# EasyEDA Pro project CR2.epro

# Schematic Schematic2
Board Name: Board2; Create Date: 2024-12-13; Page Name: P1; Project Name: kpi2024_0; Schematic Name: Schematic2; Update Date: 2024-12-13; Company: EasyEDA.com; Page Size: A4; Version: V1.0
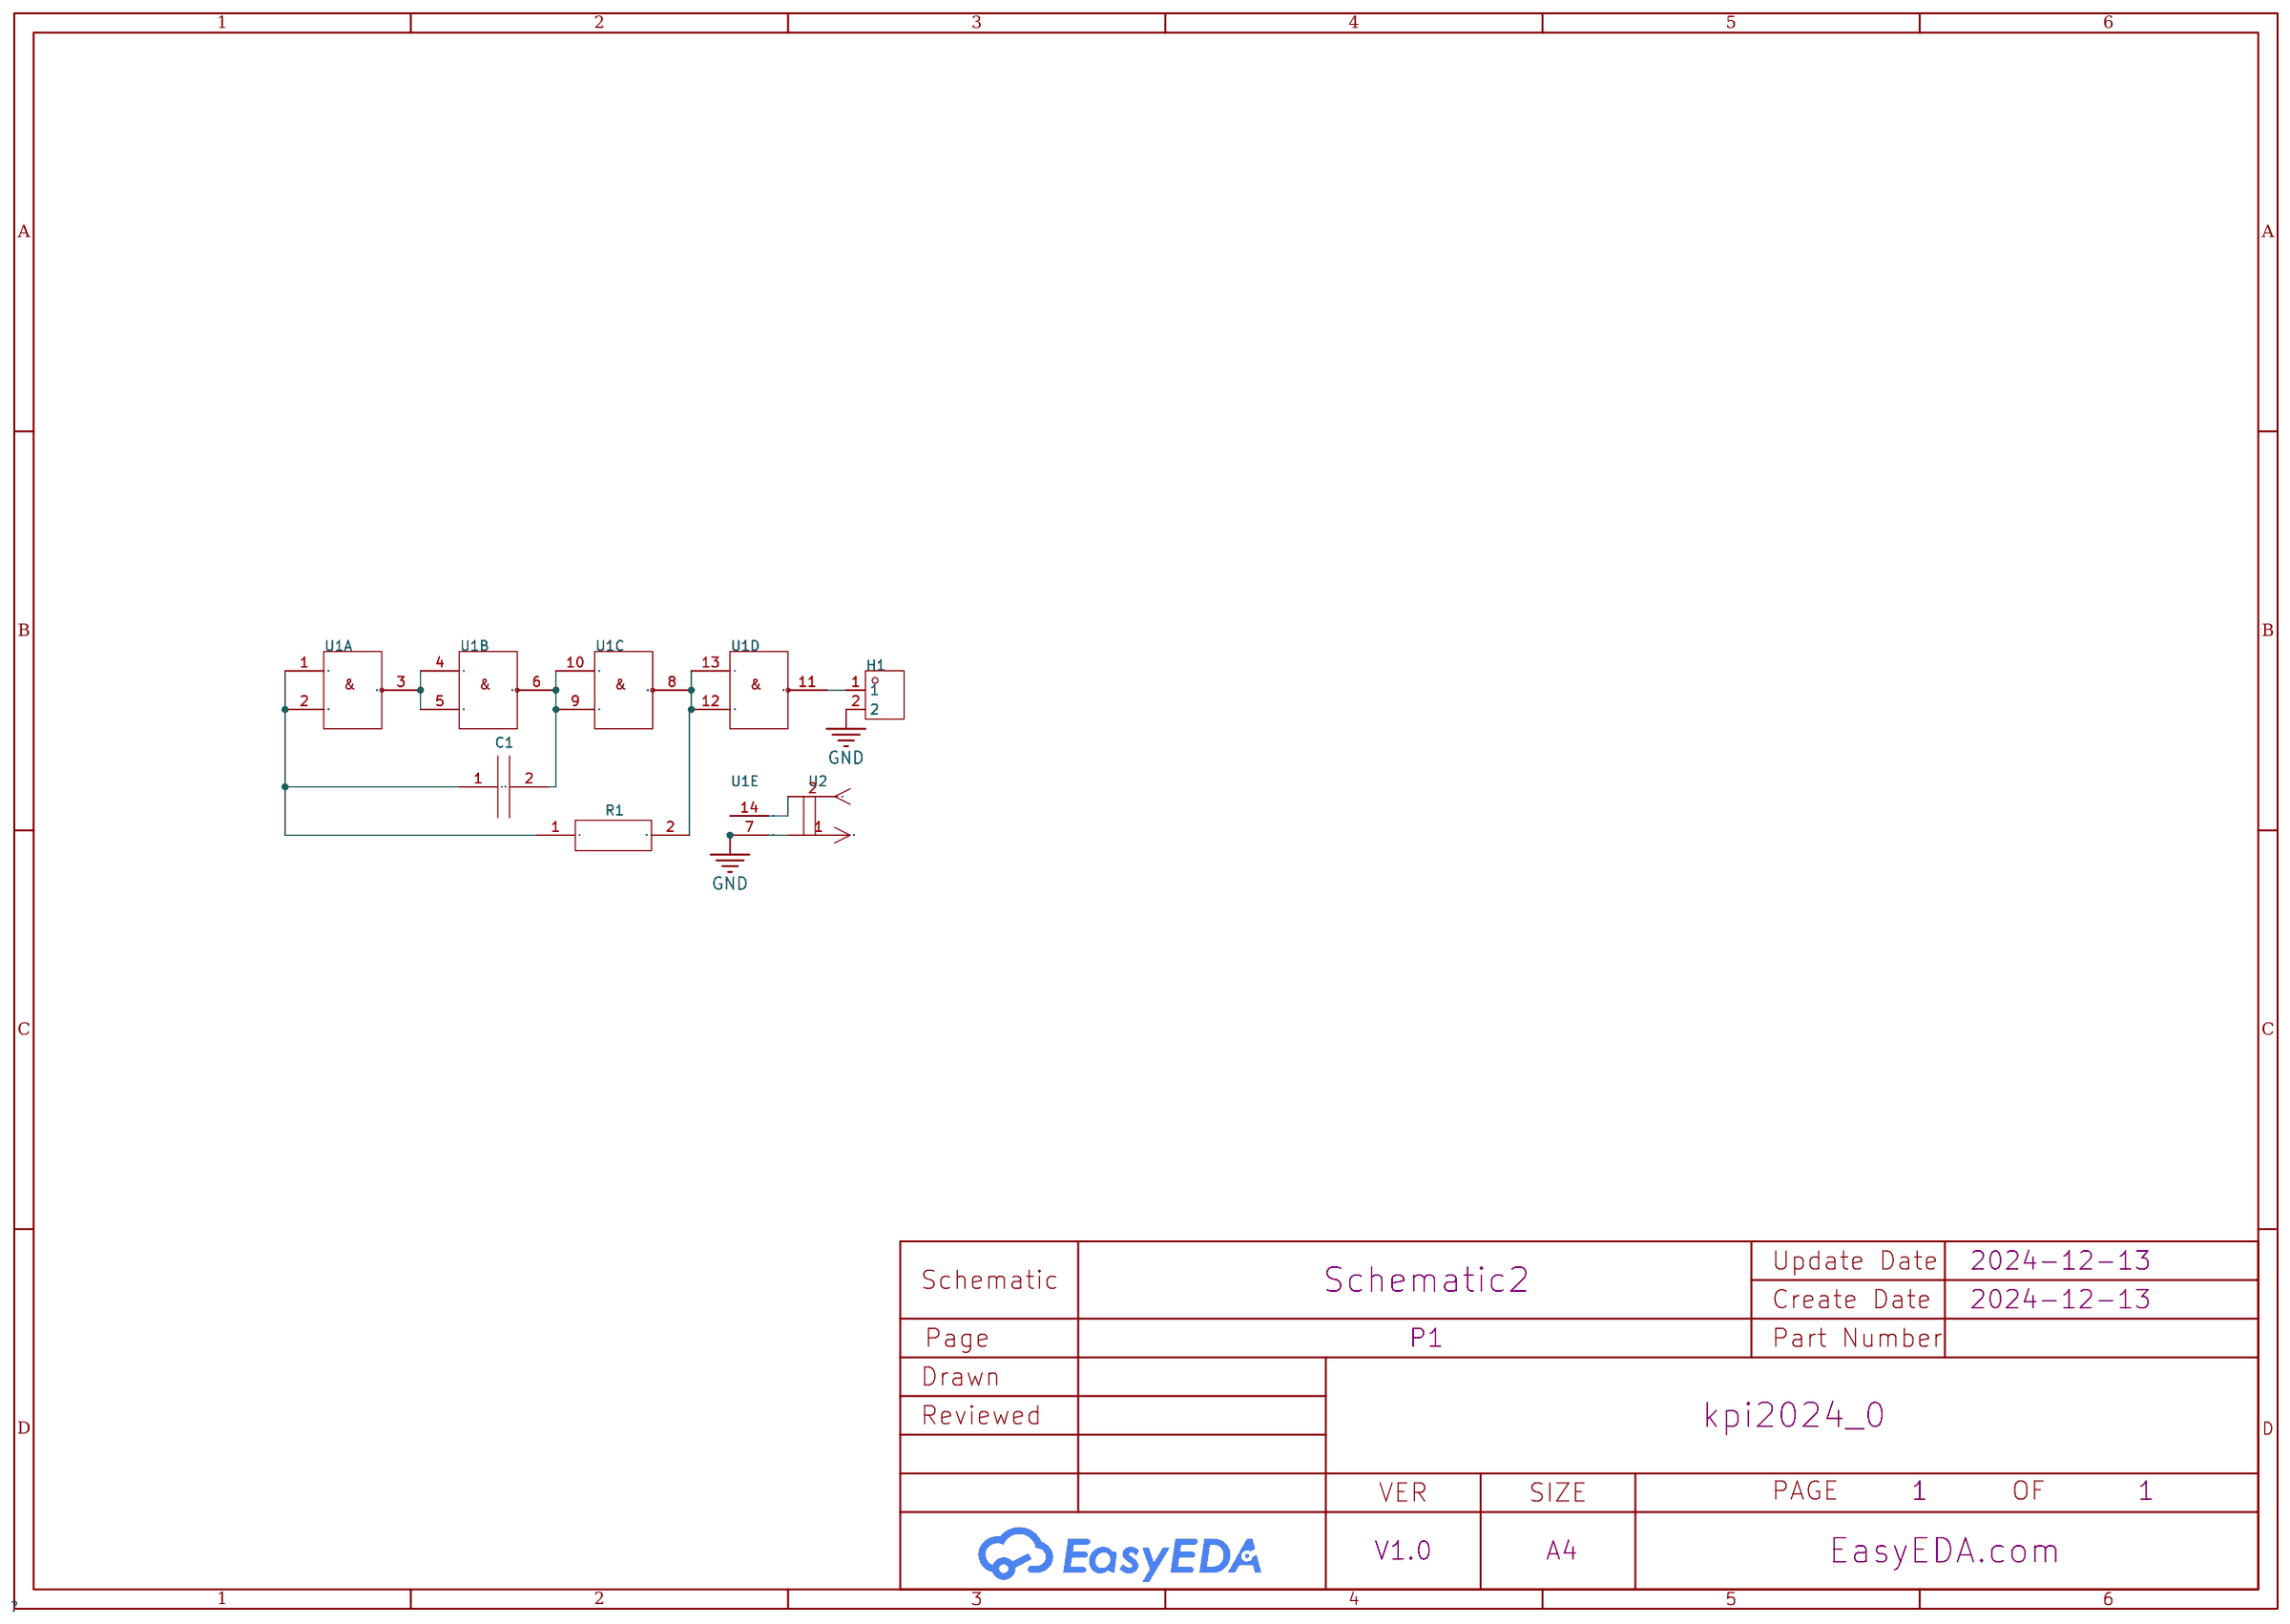
[diagram p0: schematic sheet]

## Parts
C1  -  [CAP_CERAM_L5.0D0.8]
H1  DZ200R-11-14-39  [HDR-TH_14P-P2.00-V-M]
U1  -  [PDIP-14_L19.2-W6.6-P2.54-LS7.6-BL]  (sections 1,2,3,4,5)
U2  -  [DS-210]
U3  R1  [RES_CONST_L6.0D0.8]

## Library data of the parts
C1 = Cap К10-17Б
H1 = PLS-2: Pin Structure:1x14P Pitch:2mm Circluar Pins/Square Pins:Policy Mounting Type:Direct Insert Number of Rows:Single Row Number of Pins:14P; LCSC Part Name: 1x14P 间距:2mm 方针 直插; Supplier Part: C5370380; Manufacturer: DEALON(德艺隆); Supplier Footprint: 插件,P=2mm; JLCPCB Part Class: Extended Part; Datasheet: https://atta.szlcsc.com/upload/public/pdf/source/20211231/9F8C3106172B684E6D8A34A79D0CD962.pdf; Supplier: LCSC; Pin Structure: 1x14P; Pitch: 2mm; Circluar Pins/Square Pins: Policy; Mounting Type: Direct Insert; Number of Rows: Single Row; Number of Pins: 14P
U1 = SN7400(NAND)
U2 = DS-210
U3 = Res MF 0.25

## Nets
GND: H1.2 U1.7(5) U2.1
Net-(C1-1): C1.1 U1.1 U1.2 U3.1
Net-(C1-2): C1.2 U1.6(3) U1.9(2) U1.10(1)
Net-(H1-1): H1.1 U1.11(3)
Net-(U1-3): U1.3 U1.4(1) U1.5(2)
Net-(U1-8): U1.8(3) U1.12(2) U1.13(1) U3.2
Net-(U1-14): U1.14(4) U2.2
